# EasyEDA Pro project ProPrj_HEMY 2.0_2025-04-23.epro, board PCB5_2
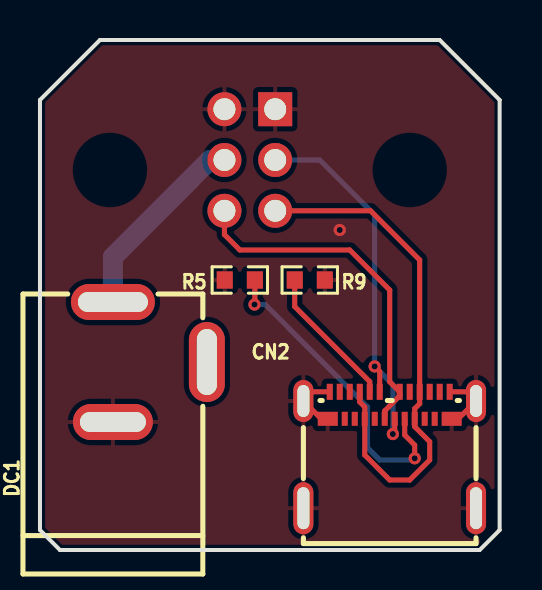
[diagram p12: board, top side]
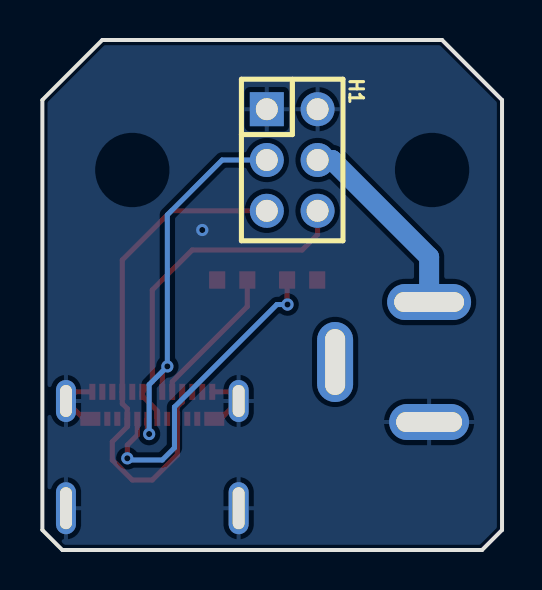
[diagram p13: board, bottom side, seen from below]

Outline 23 x 25.5 mm; copper layers: Top Layer, Bottom Layer. Coordinates in mm from the lower left corner of the outline.
Outline path: 0,22.5 3,25.5 20,25.5 23,22.5 23,1 22,0 1,0 0,1 0,22.5
Stack: Top Layer 0.035mm / Dielectric1 1.51mm FR4 er 4.5 / Bottom Layer 0.035mm

## Design rules (mm)
template: JLCPCB Capability(Two Layers Board)
spacing copperThickness1oz (default): track to track 0.102, other pairs 0.152 to 0.3
spacing copperThickness2oz: track to track 0.203, other pairs 0.152 to 0.3
track width copperThickness1oz (default): min 0.127, default 0.254, max 2.54
track width copperThickness2oz: min 0.203, default 0.254, max 2.54
differential pair differentialPair (default): width min 0.127, default 0.254, max 2.54; gap min 0.152, default 0.152
via viaSize (default): diameter min 0.5, default 0.61, max 10; hole min 0.3, default 0.305, max 6.3

## Placement (name value [footprint] x y rotation side)
CN2  USB_C  [USB-C-SMD_TYPE-C-USB-18]  17.5 5 0 top
DC1  DC-005-5A-2.0  [DC-IN-TH_DC-005-5A-2.0]  6 9.4 90 top
H1  PZ254V-12-6P  [HDR-TH_6P-P2.54-V-M-R2-C3-S2.54]  10.5 19.5 270 bottom
R5  5.1kΩ  [R0603]  10 13.5 0 top
R9  5.1kΩ  [R0603]  13.5 13.5 0 top

## Footprints (pads in the part's own frame, mm; a bottom-side part is the same pattern mirrored in y, then rotated)
DC-IN-TH_DC-005-5A-2.0
  oval 1.8x4.2 hole 1x3.5: 1(3,2.352)
  oval 1.8x4 hole 1x3.3: 2(-3,2.352)
  oval 4x1.8 hole 3.3x1: 3(-0.001,-2.352)
HDR-TH_6P-P2.54-V-M-R2-C3-S2.54
  rect 1.7x1.7 hole 1.1: 1(-2.54,-1.27)
  round 1.7 hole 1.1: 2(-2.54,1.27) 3(0,-1.27) 4(0,1.27) 5(2.54,-1.27) 6(2.54,1.27)
R0603
  rect 0.806x0.864 smd: 1(-0.753,0) 2(0.753,0)
USB-C-SMD_TYPE-C-USB-18
  oval 1x2.1 hole 0.6x1.6: 0(-4.32,2.45) 0(4.32,2.45)
  oval 1x2.6 hole 0.6x2.1: 0(-4.32,-2.91) 0(4.32,-2.91)
  rect 0.3x0.8 smd: A1(-3,2.91) A2(-2.5,2.91) A3(-2,2.91) A4(-1.5,2.91) A5(-1,2.91) A6(-0.5,2.91) A7(0.5,2.91) A8(1,2.91) A9(1.5,2.91) A10(2,2.91) A11(2.5,2.91) A12(3,2.91)
  rect 1x0.7 smd: B1(3.1,1.56)
  rect 0.3x0.7 smd: B2(2.25,1.56) B3(1.75,1.56) B4(1.25,1.56) B5(0.75,1.56) B6(0.25,1.56) B7(-0.25,1.56) B8(-0.75,1.56) B9(-1.25,1.56) B10(-1.75,1.56) B11(-2.25,1.56)
  custom 1x0.7 smd: B12(-3.1,1.56)

## Nets
As in the schematic.

Pads without a net: CN2 A2 A3 A8 A10 A11 B2 B3 B8 B10 B11; DC1 3

## Via types
v1: diameter 0.61, hole 0.305, Top Layer to Bottom Layer, 5 vias

## Routing (per net, layer and track width the routed paths; a pad name or vN(x,y) marks a point on that pad's centre or on a via; arc(x,y) is an arc through that point)
GND: length 6.2
  Top Layer w0.254: CN2.B12 14.07,6.56 CN2.0 13.64,7.91 CN2.A1 ; CN2.B1 20.93,6.56 CN2.0 21.36,7.91 CN2.A12
  vias: v1(15,16)
D+: length 19.6
  Top Layer w0.254: CN2.B6 17.75,5.89 v1(17.66,5.8) ; v1(16.75,9.18) 17,8.93 CN2.A6
  Bottom Layer w0.254: v1(17.66,5.8) 17.66,8.27 v1(16.75,9.18) 16.75,16.75 14,19.5 H1.3
D-: length 17.6
  Top Layer w0.254: H1.6 9.23,15.77 10,15 15.5,15 17.5,13 17.5,8.41 CN2.A7 18,7.7 17.25,6.95 CN2.B7
VUSB_IN: length 26.1
  Top Layer w0.254: H1.5 16.54,16.96 19,14.5 CN2.A9 19,7.32 18.75,7.07 CN2.B4 18.75,6.17 19.5,5.42 19.5,4.5 18.5,3.5 17.5,3.5 16.25,4.75 CN2.B9 16.25,7.15 16,7.4 CN2.A4
$1N564: length 9.8
  Bottom Layer w1: H1.4 8.5,19.5 3.65,14.65 DC1.1
$1N1653: length 15.9
  Top Layer w0.254: v1(10.73,12.27) 10.75,12.29 R5.2 ; v1(18.75,4.58) 18.75,5.25 18.25,5.75 CN2.B5
  Bottom Layer w0.254: v1(18.75,4.58) 18.67,4.5 17,4.5 16.39,5.11 16.39,7.15 11.27,12.27 v1(10.73,12.27)
$1N1655: length 7.1
  Top Layer w0.254: CN2.A5 16.5,8.42 12.75,12.17 R9.1

## Copper pours and planes (outline as drawn; the poured copper is in the pictures)
GND on Top Layer: -24.81,65.38 41.62,65.38 41.62,-2.83 -24.81,-2.83
GND on Bottom Layer: -24.81,65.38 41.62,65.38 41.62,-3.83 -24.81,-3.83
